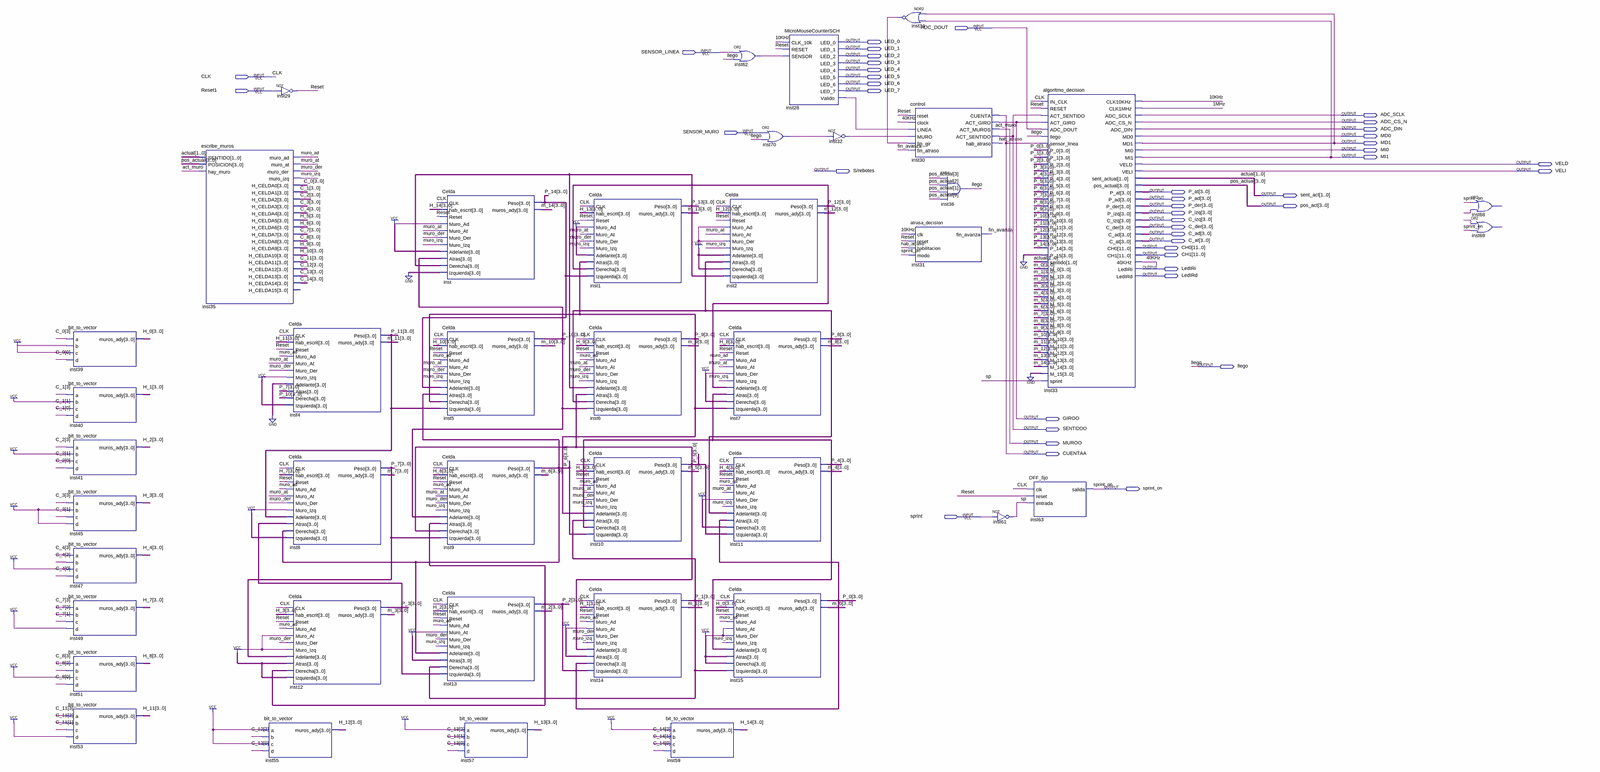
[diagram p0: schematic sheet, whole]
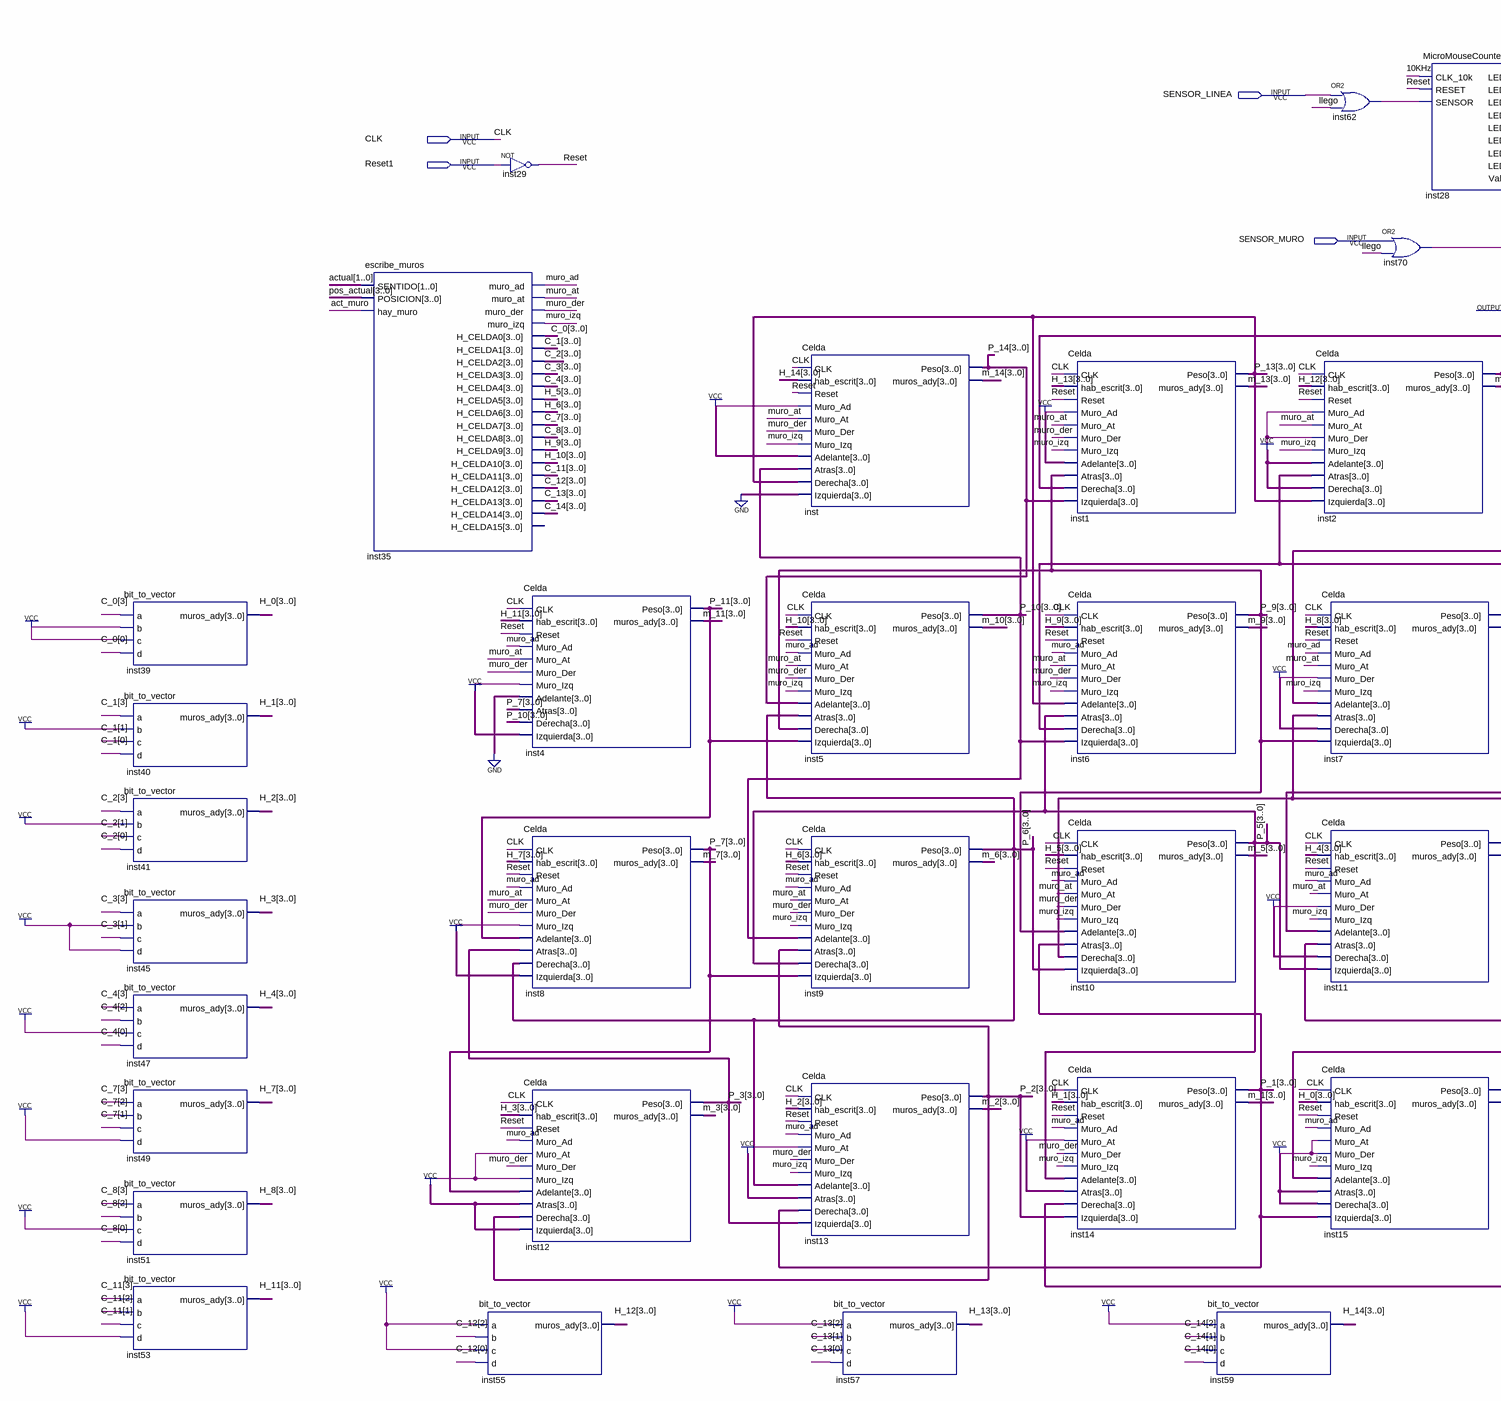
[diagram p1: schematic sheet, left part]
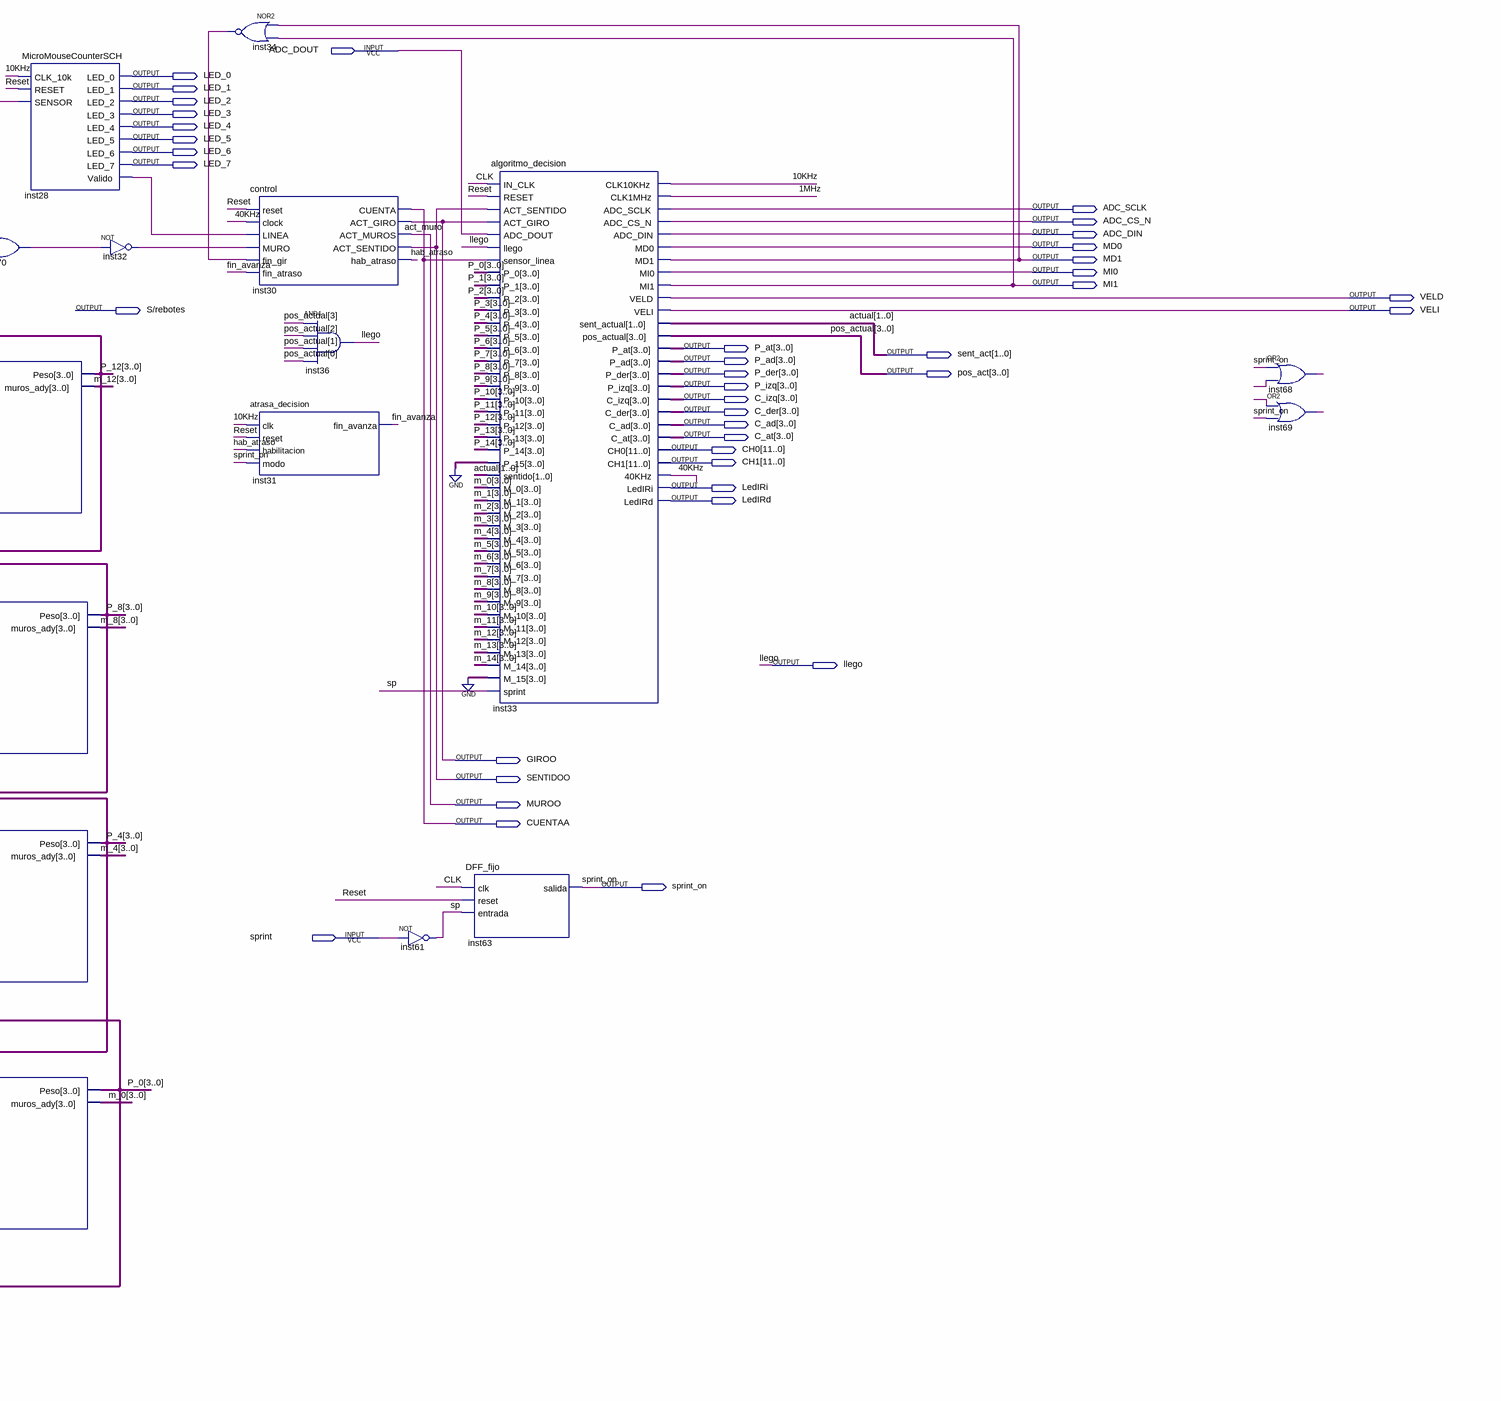
[diagram p2: schematic sheet, right part]
// Quartus schematic Matriz_ubicacion.bdf as structural Verilog: 41 symbols, 44 pins
module Matriz_ubicacion (
  input  ADC_DOUT,
  input  SENSOR_LINEA,
  input  CLK,
  input  Reset1,
  input  SENSOR_MURO,
  input  sprint,
  output LED_0,
  output LED_1,
  output LED_2,
  output LED_3,
  output LED_4,
  output LED_5,
  output LED_6,
  output LED_7,
  output ADC_SCLK,
  output ADC_CS_N,
  output ADC_DIN,
  output MD0,
  output MD1,
  output MI0,
  output MI1,
  output VELD,
  output \S/rebotes ,
  output VELI,
  output [3:0] P_at,
  output [1:0] sent_act,
  output [3:0] P_ad,
  output [3:0] P_der,
  output [3:0] pos_act,
  output [3:0] P_izq,
  output [3:0] C_izq,
  output [3:0] C_der,
  output [3:0] C_ad,
  output [3:0] C_at,
  output [11:0] CH0,
  output [11:0] CH1,
  output LedIRi,
  output LedIRd,
  output llego,
  output GIROO,
  output SENTIDOO,
  output MUROO,
  output CUENTAA,
  output sprint_on
);

  wire \1MHz , \10KHz , \40KHz , fin_avanza, hab_atraso, inst28_valido, inst32_out, inst34_out, inst62_out,
       inst68_out, inst69_out, inst70_out, muro_ad, muro_at, muro_der, muro_izq, Reset, sp, undriven,
       undriven_2, undriven_3, undriven_4, undriven_5, undriven_6, undriven_7, undriven_8, undriven_9,
       undriven_10, undriven_11, undriven_12, undriven_13;
  wire [3:0] C_0, C_1, C_2, C_3, C_4, C_7, C_8, C_11, C_12, C_13, C_14, H_0, H_1, H_2, H_3, H_4, H_5, H_6,
       H_7, H_8, H_9, H_10, H_11, H_12, H_13, H_14, m_0, m_1, m_2, m_3, m_4, m_5, m_6, m_7, m_8, m_9, m_10,
       m_11, m_12, m_13, m_14, P_0, P_1, P_2, P_3, P_4, P_5, P_6, P_7, P_8, P_9, P_10, P_11, P_12, P_13, P_14;

  bit_to_vector inst39 (.a(C_0[3]), .b(1'b1), .c(1'b1), .d(C_0[0]), .muros_ady(H_0));
  bit_to_vector inst40 (.a(C_1[3]), .b(1'b1), .c(C_1[1]), .d(C_1[0]), .muros_ady(H_1));
  bit_to_vector inst41 (.a(C_2[3]), .b(1'b1), .c(C_2[1]), .d(C_2[0]), .muros_ady(H_2));
  bit_to_vector inst45 (.a(C_3[3]), .b(1'b1), .c(C_3[1]), .d(1'b1), .muros_ady(H_3));
  bit_to_vector inst47 (.a(C_4[3]), .b(C_4[2]), .c(1'b1), .d(C_4[0]), .muros_ady(H_4));
  bit_to_vector inst49 (.a(C_7[3]), .b(C_7[2]), .c(C_7[1]), .d(1'b1), .muros_ady(H_7));
  bit_to_vector inst51 (.a(C_8[3]), .b(C_8[2]), .c(1'b1), .d(C_8[0]), .muros_ady(H_8));
  bit_to_vector inst53 (.a(C_11[3]), .b(C_11[2]), .c(C_11[1]), .d(1'b1), .muros_ady(H_11));
  escribe_muros inst35 (
    .SENTIDO(sent_act), .POSICION(pos_act), .hay_muro(MUROO), .muro_ad(muro_ad), .muro_at(muro_at),
    .muro_der(muro_der), .muro_izq(muro_izq), .H_CELDA0(C_0), .H_CELDA1(C_1), .H_CELDA2(C_2), .H_CELDA3(C_3),
    .H_CELDA4(C_4), .H_CELDA5(H_5), .H_CELDA6(H_6), .H_CELDA7(C_7), .H_CELDA8(C_8), .H_CELDA9(H_9),
    .H_CELDA10(H_10), .H_CELDA11(C_11), .H_CELDA12(C_12), .H_CELDA13(C_13), .H_CELDA14(C_14));  // open: H_CELDA15
  not inst29 (Reset, Reset1);
  bit_to_vector inst55 (.a(1'b1), .b(C_12[2]), .c(1'b1), .d(C_12[0]), .muros_ady(H_12));
  Celda inst4 (
    .CLK(CLK), .hab_escrit(H_11), .Reset(Reset), .Muro_Ad(muro_ad), .Muro_At(muro_at), .Muro_Der(muro_der),
    .Muro_Izq(undriven), .Adelante(4'b0000), .Atras(P_7), .Derecha(P_10), .Izquierda(4'b1111), .Peso(P_11),
    .muros_ady(m_11));
  Celda inst8 (
    .CLK(CLK), .hab_escrit(H_7), .Reset(Reset), .Muro_Ad(muro_ad), .Muro_At(muro_at), .Muro_Der(muro_der),
    .Muro_Izq(undriven_2), .Adelante(P_11), .Atras(P_3), .Derecha(P_6), .Izquierda(4'b1111), .Peso(P_7),
    .muros_ady(m_7));
  Celda inst12 (
    .CLK(CLK), .hab_escrit(H_3), .Reset(Reset), .Muro_Ad(muro_ad), .Muro_At(undriven_3), .Muro_Der(muro_der),
    .Muro_Izq(undriven_3), .Adelante(P_7), .Atras(4'b1111), .Derecha(P_2), .Izquierda(4'b1111), .Peso(P_3),
    .muros_ady(m_3));
  Celda inst (
    .CLK(CLK), .hab_escrit(H_14), .Reset(Reset), .Muro_Ad(undriven_11), .Muro_At(muro_at),
    .Muro_Der(muro_der), .Muro_Izq(muro_izq), .Adelante(4'b1111), .Atras(P_10), .Derecha(P_13),
    .Izquierda(4'b0000), .Peso(P_14), .muros_ady(m_14));
  Celda inst5 (
    .CLK(CLK), .hab_escrit(H_10), .Reset(Reset), .Muro_Ad(muro_ad), .Muro_At(muro_at), .Muro_Der(muro_der),
    .Muro_Izq(muro_izq), .Adelante(P_14), .Atras(P_6), .Derecha(P_9), .Izquierda(P_11), .Peso(P_10),
    .muros_ady(m_10));
  Celda inst9 (
    .CLK(CLK), .hab_escrit(H_6), .Reset(Reset), .Muro_Ad(muro_ad), .Muro_At(muro_at), .Muro_Der(muro_der),
    .Muro_Izq(muro_izq), .Adelante(P_10), .Atras(P_2), .Derecha(P_5), .Izquierda(P_7), .Peso(P_6),
    .muros_ady(m_6));
  Celda inst13 (
    .CLK(CLK), .hab_escrit(H_2), .Reset(Reset), .Muro_Ad(muro_ad), .Muro_At(undriven_4), .Muro_Der(muro_der),
    .Muro_Izq(muro_izq), .Adelante(P_6), .Atras(4'b1111), .Derecha(P_1), .Izquierda(P_3), .Peso(P_2),
    .muros_ady(m_2));
  bit_to_vector inst57 (.a(1'b1), .b(C_13[2]), .c(C_13[1]), .d(C_13[0]), .muros_ady(H_13));
  Celda inst1 (
    .CLK(CLK), .hab_escrit(H_13), .Reset(Reset), .Muro_Ad(undriven_8), .Muro_At(muro_at),
    .Muro_Der(muro_der), .Muro_Izq(muro_izq), .Adelante(4'b1111), .Atras(P_9), .Derecha(P_12),
    .Izquierda(P_14), .Peso(P_13), .muros_ady(m_13));
  Celda inst6 (
    .CLK(CLK), .hab_escrit(H_9), .Reset(Reset), .Muro_Ad(muro_ad), .Muro_At(muro_at), .Muro_Der(muro_der),
    .Muro_Izq(muro_izq), .Adelante(P_13), .Atras(P_5), .Derecha(P_8), .Izquierda(P_10), .Peso(P_9),
    .muros_ady(m_9));
  Celda inst10 (
    .CLK(CLK), .hab_escrit(H_5), .Reset(Reset), .Muro_Ad(muro_ad), .Muro_At(muro_at), .Muro_Der(muro_der),
    .Muro_Izq(muro_izq), .Adelante(P_9), .Atras(P_1), .Derecha(P_4), .Izquierda(P_6), .Peso(P_5),
    .muros_ady(m_5));
  Celda inst14 (
    .CLK(CLK), .hab_escrit(H_1), .Reset(Reset), .Muro_Ad(muro_ad), .Muro_At(undriven_9), .Muro_Der(muro_der),
    .Muro_Izq(muro_izq), .Adelante(P_5), .Atras(4'b1111), .Derecha(P_0), .Izquierda(P_2), .Peso(P_1),
    .muros_ady(m_1));
  bit_to_vector inst59 (.a(1'b1), .b(C_14[2]), .c(C_14[1]), .d(C_14[0]), .muros_ady(H_14));
  Celda inst2 (
    .CLK(CLK), .hab_escrit(H_12), .Reset(Reset), .Muro_Ad(undriven_10), .Muro_At(muro_at),
    .Muro_Der(undriven_10), .Muro_Izq(muro_izq), .Adelante(4'b1111), .Atras(P_8), .Derecha(4'b1111),
    .Izquierda(P_13), .Peso(P_12), .muros_ady(m_12));
  Celda inst7 (
    .CLK(CLK), .hab_escrit(H_8), .Reset(Reset), .Muro_Ad(muro_ad), .Muro_At(muro_at), .Muro_Der(undriven_5),
    .Muro_Izq(muro_izq), .Adelante(P_12), .Atras(P_4), .Derecha(4'b1111), .Izquierda(P_9), .Peso(P_8),
    .muros_ady(m_8));
  Celda inst11 (
    .CLK(CLK), .hab_escrit(H_4), .Reset(Reset), .Muro_Ad(muro_ad), .Muro_At(muro_at), .Muro_Der(undriven_6),
    .Muro_Izq(muro_izq), .Adelante(P_8), .Atras(P_0), .Derecha(4'b1111), .Izquierda(P_5), .Peso(P_4),
    .muros_ady(m_4));
  Celda inst15 (
    .CLK(CLK), .hab_escrit(H_0), .Reset(Reset), .Muro_Ad(muro_ad), .Muro_At(undriven_7),
    .Muro_Der(undriven_7), .Muro_Izq(muro_izq), .Adelante(P_4), .Atras(4'b1111), .Derecha(4'b1111),
    .Izquierda(P_1), .Peso(P_0), .muros_ady(m_0));
  or inst62 (inst62_out, SENSOR_LINEA, llego);
  MicroMouseCounterSCH inst28 (
    .CLK_10k(\10KHz ), .RESET(Reset), .SENSOR(inst62_out), .LED_0(LED_0), .LED_1(LED_1), .LED_2(LED_2),
    .LED_3(LED_3), .LED_4(LED_4), .LED_5(LED_5), .LED_6(LED_6), .LED_7(LED_7), .Valido(inst28_valido));
  or inst70 (inst70_out, SENSOR_MURO, llego);
  not inst32 (inst32_out, inst70_out);
  nor inst34 (inst34_out, MD1, MI1);
  control inst30 (
    .reset(Reset), .clock(\40KHz ), .LINEA(inst28_valido), .MURO(inst32_out), .fin_gir(inst34_out),
    .fin_atraso(fin_avanza), .CUENTA(CUENTAA), .ACT_GIRO(GIROO), .ACT_MUROS(MUROO), .ACT_SENTIDO(SENTIDOO),
    .hab_atraso(hab_atraso));
  atrasa_decision inst31 (
    .clk(\10KHz ), .reset(Reset), .habilitacion(hab_atraso), .modo(sprint_on), .fin_avanza(fin_avanza));
  and inst36 (llego, pos_act[3], pos_act[2], pos_act[1], pos_act[0]);
  not inst61 (sp, sprint);
  DFF_fijo inst63 (.clk(CLK), .reset(Reset), .entrada(sp), .salida(sprint_on));
  algoritmo_decision inst33 (
    .IN_CLK(CLK), .RESET(Reset), .ACT_SENTIDO(SENTIDOO), .ACT_GIRO(GIROO), .ADC_DOUT(ADC_DOUT),
    .llego(llego), .sensor_linea(CUENTAA), .P_0(P_0), .P_1(P_1), .P_2(P_2), .P_3(P_3), .P_4(P_4), .P_5(P_5),
    .P_6(P_6), .P_7(P_7), .P_8(P_8), .P_9(P_9), .P_10(P_10), .P_11(P_11), .P_12(P_12), .P_13(P_13),
    .P_14(P_14), .P_15(4'b0000), .sentido(sent_act), .M_0(m_0), .M_1(m_1), .M_2(m_2), .M_3(m_3), .M_4(m_4),
    .M_5(m_5), .M_6(m_6), .M_7(m_7), .M_8(m_8), .M_9(m_9), .M_10(m_10), .M_11(m_11), .M_12(m_12),
    .M_13(m_13), .M_14(m_14), .M_15(4'b0000), .sprint(sp), .CLK10KHz(\10KHz ), .CLK1MHz(\1MHz ),
    .ADC_SCLK(ADC_SCLK), .ADC_CS_N(ADC_CS_N), .ADC_DIN(ADC_DIN), .MD0(MD0), .MD1(MD1), .MI0(MI0), .MI1(MI1),
    .VELD(VELD), .VELI(VELI), .sent_actual(sent_act), .pos_actual(pos_act), .P_at(P_at), .P_ad(P_ad),
    .P_der(P_der), .P_izq(P_izq), .C_izq(C_izq), .C_der(C_der), .C_ad(C_ad), .C_at(C_at), .CH0(CH0),
    .CH1(CH1), .\40KHz (\40KHz ), .LedIRi(LedIRi), .LedIRd(LedIRd));
  or inst68 (inst68_out, sprint_on, undriven_12);
  or inst69 (inst69_out, undriven_13, sprint_on);

  // Other names for the same wires on the sheet: act_muro = MUROO; pos_actual[3:0] = pos_act; actual[1:0] = sent_act
endmodule
